# EAGLE design Button - Single (EAGLE 6.5.0)
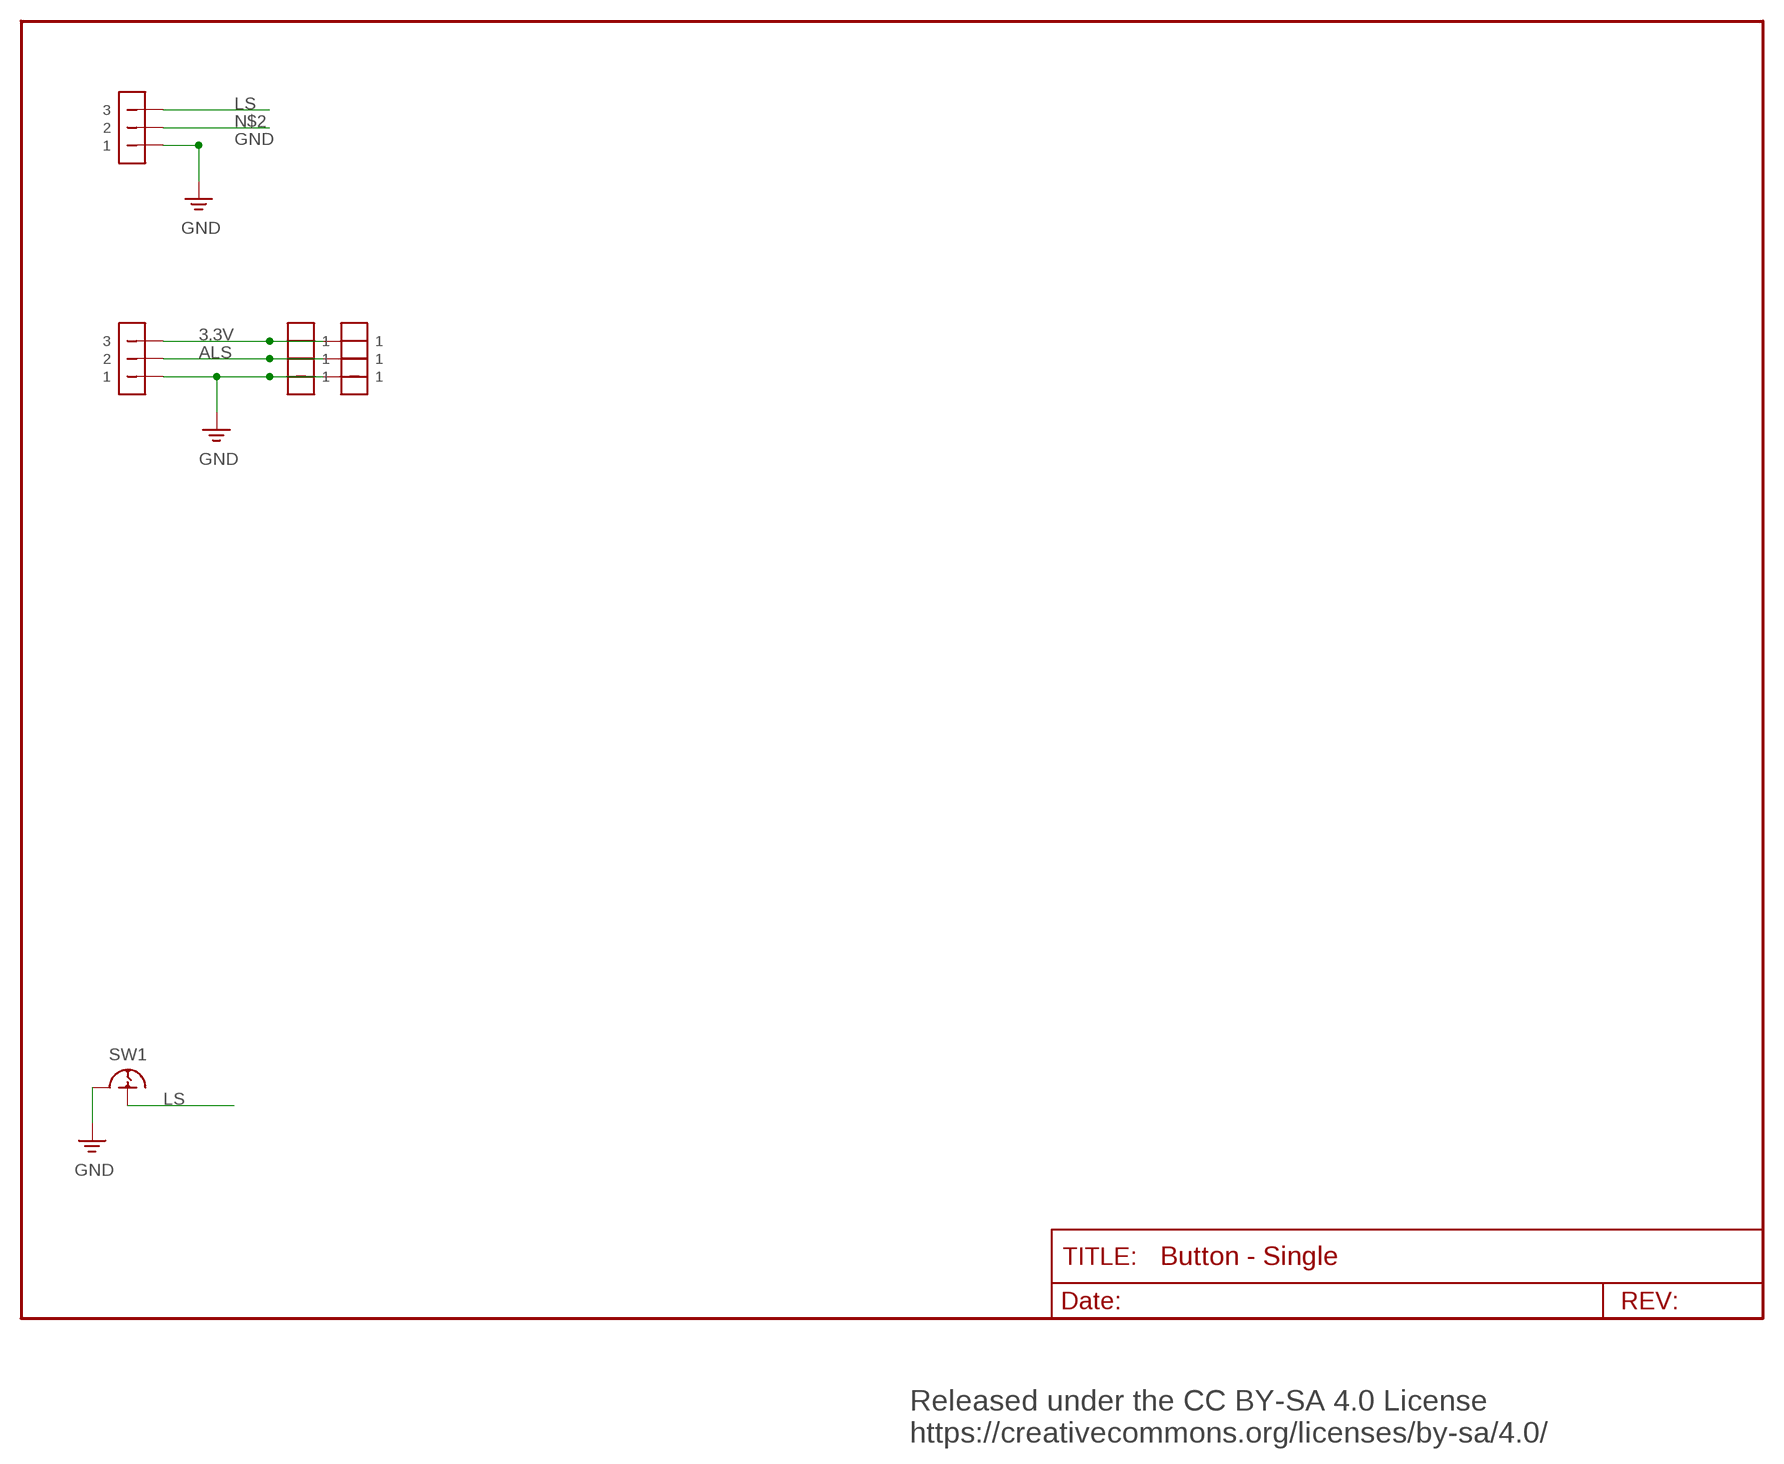
[diagram p0: schematic, sheet 1]

## Parts
SW1  U12390  [UFTCGX12]
U$1  M03  [M03]
U$2  M03  [M03]
U$3  S01-4MM  [S01-4MM]
U$4  S01-4MM  [S01-4MM]
U$5  S01-4MM  [S01-4MM]
U$6  S01-4MM  [S01-4MM]
U$7  S01-4MM  [S01-4MM]
U$8  S01-4MM  [S01-4MM]

## Nets
3.3V: U$1.3 U$3.P$1 U$6.P$1
ALS: U$1.2 U$4.P$1 U$7.P$1
GND: SW1.GND U$1.1 U$2.1 U$5.P$1 U$8.P$1
LS: SW1.SIG U$2.3
N$2: U$2.2

## Notes on the sheet
- Released under the CC BY-SA 4.0 License 
  https://creativecommons.org/licenses/by-sa/4.0/

## Library data of the parts
SW1 = snaptron:U12390
U$1 U$2 = pinhead-half:M03
U$3-U$8 = pinhead-half:S01-4MM

## Net classes
1 Tline: width 0.003 mm, drill 0.33 mm

## Board
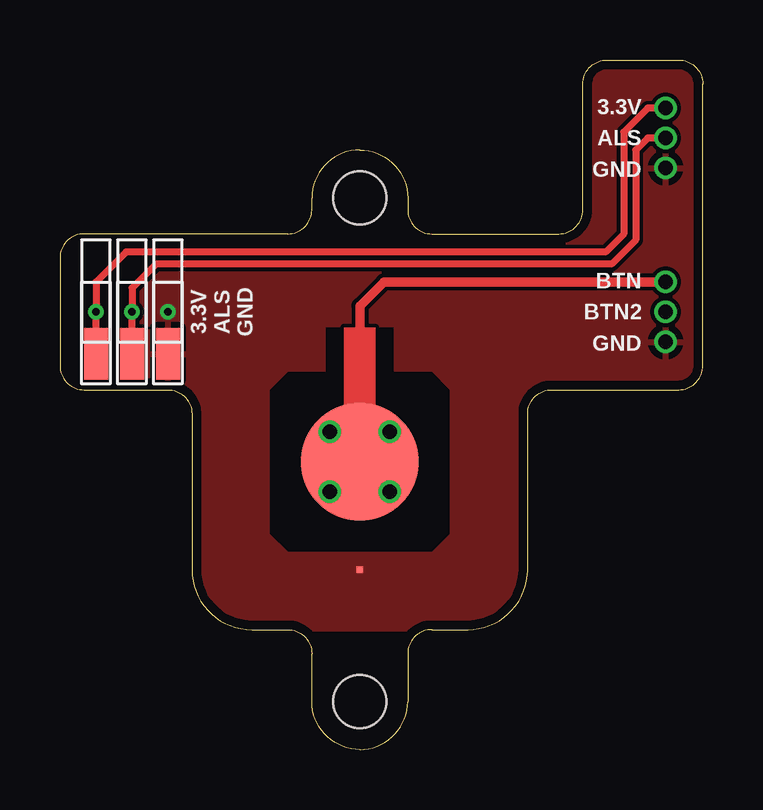
[diagram p1: board, top side]
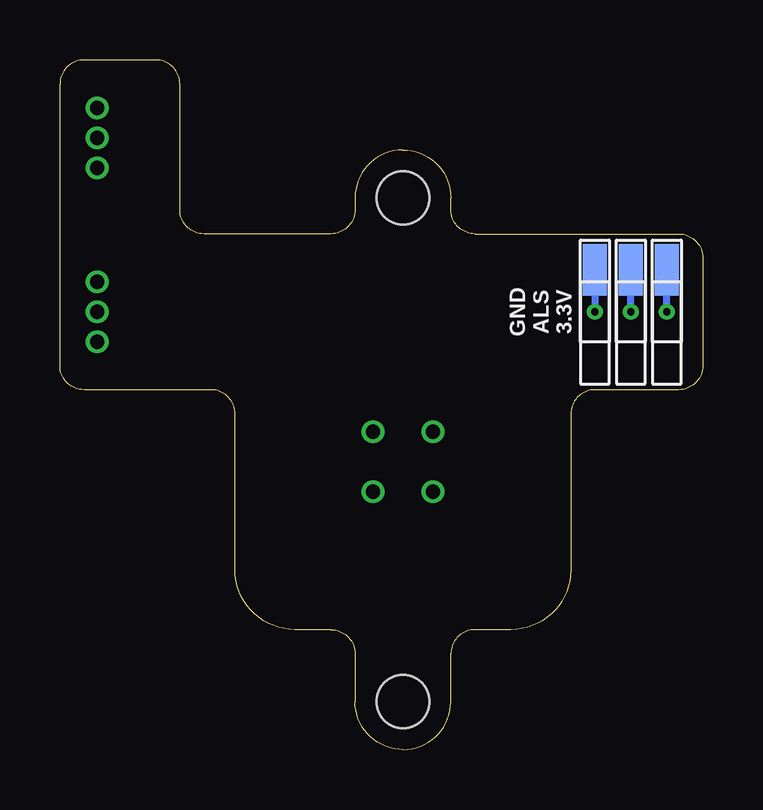
[diagram p2: board, bottom side, seen from below]

Size 26.8 x 28.75 mm. Coordinates in mm from the lower left corner, seen from the top.
Outline: 14.5,23 14.5,22.5 arc90 15.5,21.5 20.8,21.5 arc90 21.8,22.5 21.8,27.75 arc-90 22.8,28.75 25.8,28.75 arc-90 26.8,27.75 26.8,16 arc-90 25.8,15 20.5,15 arc90 19.5,14 19.5,7.5 arc-90 17,5 15.5,5 arc90 14.5,4 14.5,2 arc-90 12.5,0 arc-90 10.5,2 10.5,4 arc90 9.5,5 8,5 arc-90 5.5,7.5 5.5,14 arc90 4.5,15 1,15 arc-90 0,16 0,20.5 arc-90 1,21.5 9.5,21.5 arc90 10.5,22.5 10.5,23 arc-90 12.5,25 arc-90 14.5,23
Copper layers (1*16): Top 0.0356mm / dielectric 1.5011mm / Bottom 0.0356mm
Design rules "LaenPCBOrder *": minimum track width 6mil, minimum drill 13mil, track to track 6mil, track to pad 6mil, pad to pad 6mil, via to via 6mil, smd to smd 6mil, copper to edge 15mil, drill to drill 6mil, minimum pad ring 7mil, minimum via ring 7mil, stop-mask expansion 3mil, vias tented up to drill 15mil, thermal gap 10mil
Holes 2.2 mm at 12.5,23 12.5,2

### Footprints (pad centres in the part's own frame; a part is rotated, then mirrored left to right if it is on the bottom)
UFTCGX12 = smd 0.254 x 0.254: GND -4.5,0 | smd 4.9 x 4.9: SIG 0,0
M03 = drill 0.6: 1 0,-1.25; 2 0,0; 3 0,1.25
S01-4MM = smd 2.15 x 1: P$1 0,0

### Placement (x,y rotation side)
SW1  12.5,12 90 top
U$1  25.25,25.5 0 top
U$2  25.25,18.25 0 top
U$3  1.5,16.5 90 top
U$4  3,16.5 90 top
U$5  4.5,16.5 90 top
U$6  1.5,20 270 bottom
U$7  3,20 270 bottom
U$8  4.5,20 270 bottom

### Tracks (layer width: path | path; a pad name or v marks a point on that pad's centre or on a via)
3.3V  (via drill 0.3)
  Top 0.3: U$3.P$1 v1.5,18.25 1.5,19.5 2.75,20.75 22.75,20.75 23.5,21.5 23.5,25.75 24.5,26.75 U$1.3
  Bottom 0.3: v1.5,18.25 U$6.P$1
ALS  (via drill 0.3)
  Top 0.3: U$4.P$1 v3,18.25 3,19.25 4,20.25 23,20.25 24,21.25 24,25 24.5,25.5 U$1.2
  Bottom 0.3: v3,18.25 U$7.P$1
GND  (via drill 0.3)
  Bottom 0.3: U$8.P$1 v4.5,18.25
  pour Top: 29.25,5 -3.25,5 -3.25,29.75 29.25,29.75
LS  (via drill 0.6)
  Top 0.4: U$2.3 13.5,19.5 12.5,18.5 SW1.SIG
  Top 0.406: SW1.SIG v13.75,10.75 | v13.75,13.25 SW1.SIG | v11.25,10.75 SW1.SIG | v11.25,13.25 SW1.SIG

### Text on the board
tPlace: 3.3V / ALS / GND | 3.3V / ALS / GND | BTN / BTN2 / GND
bPlace: GND / ALS / 3.3V
tValues: Released under the CC BY-SA 4.0 License / https://creativecommons.org/licenses/by-sa/4.0/